# EAGLE schematic GND SATION PCB 1.01 (EAGLE 9.6.2)
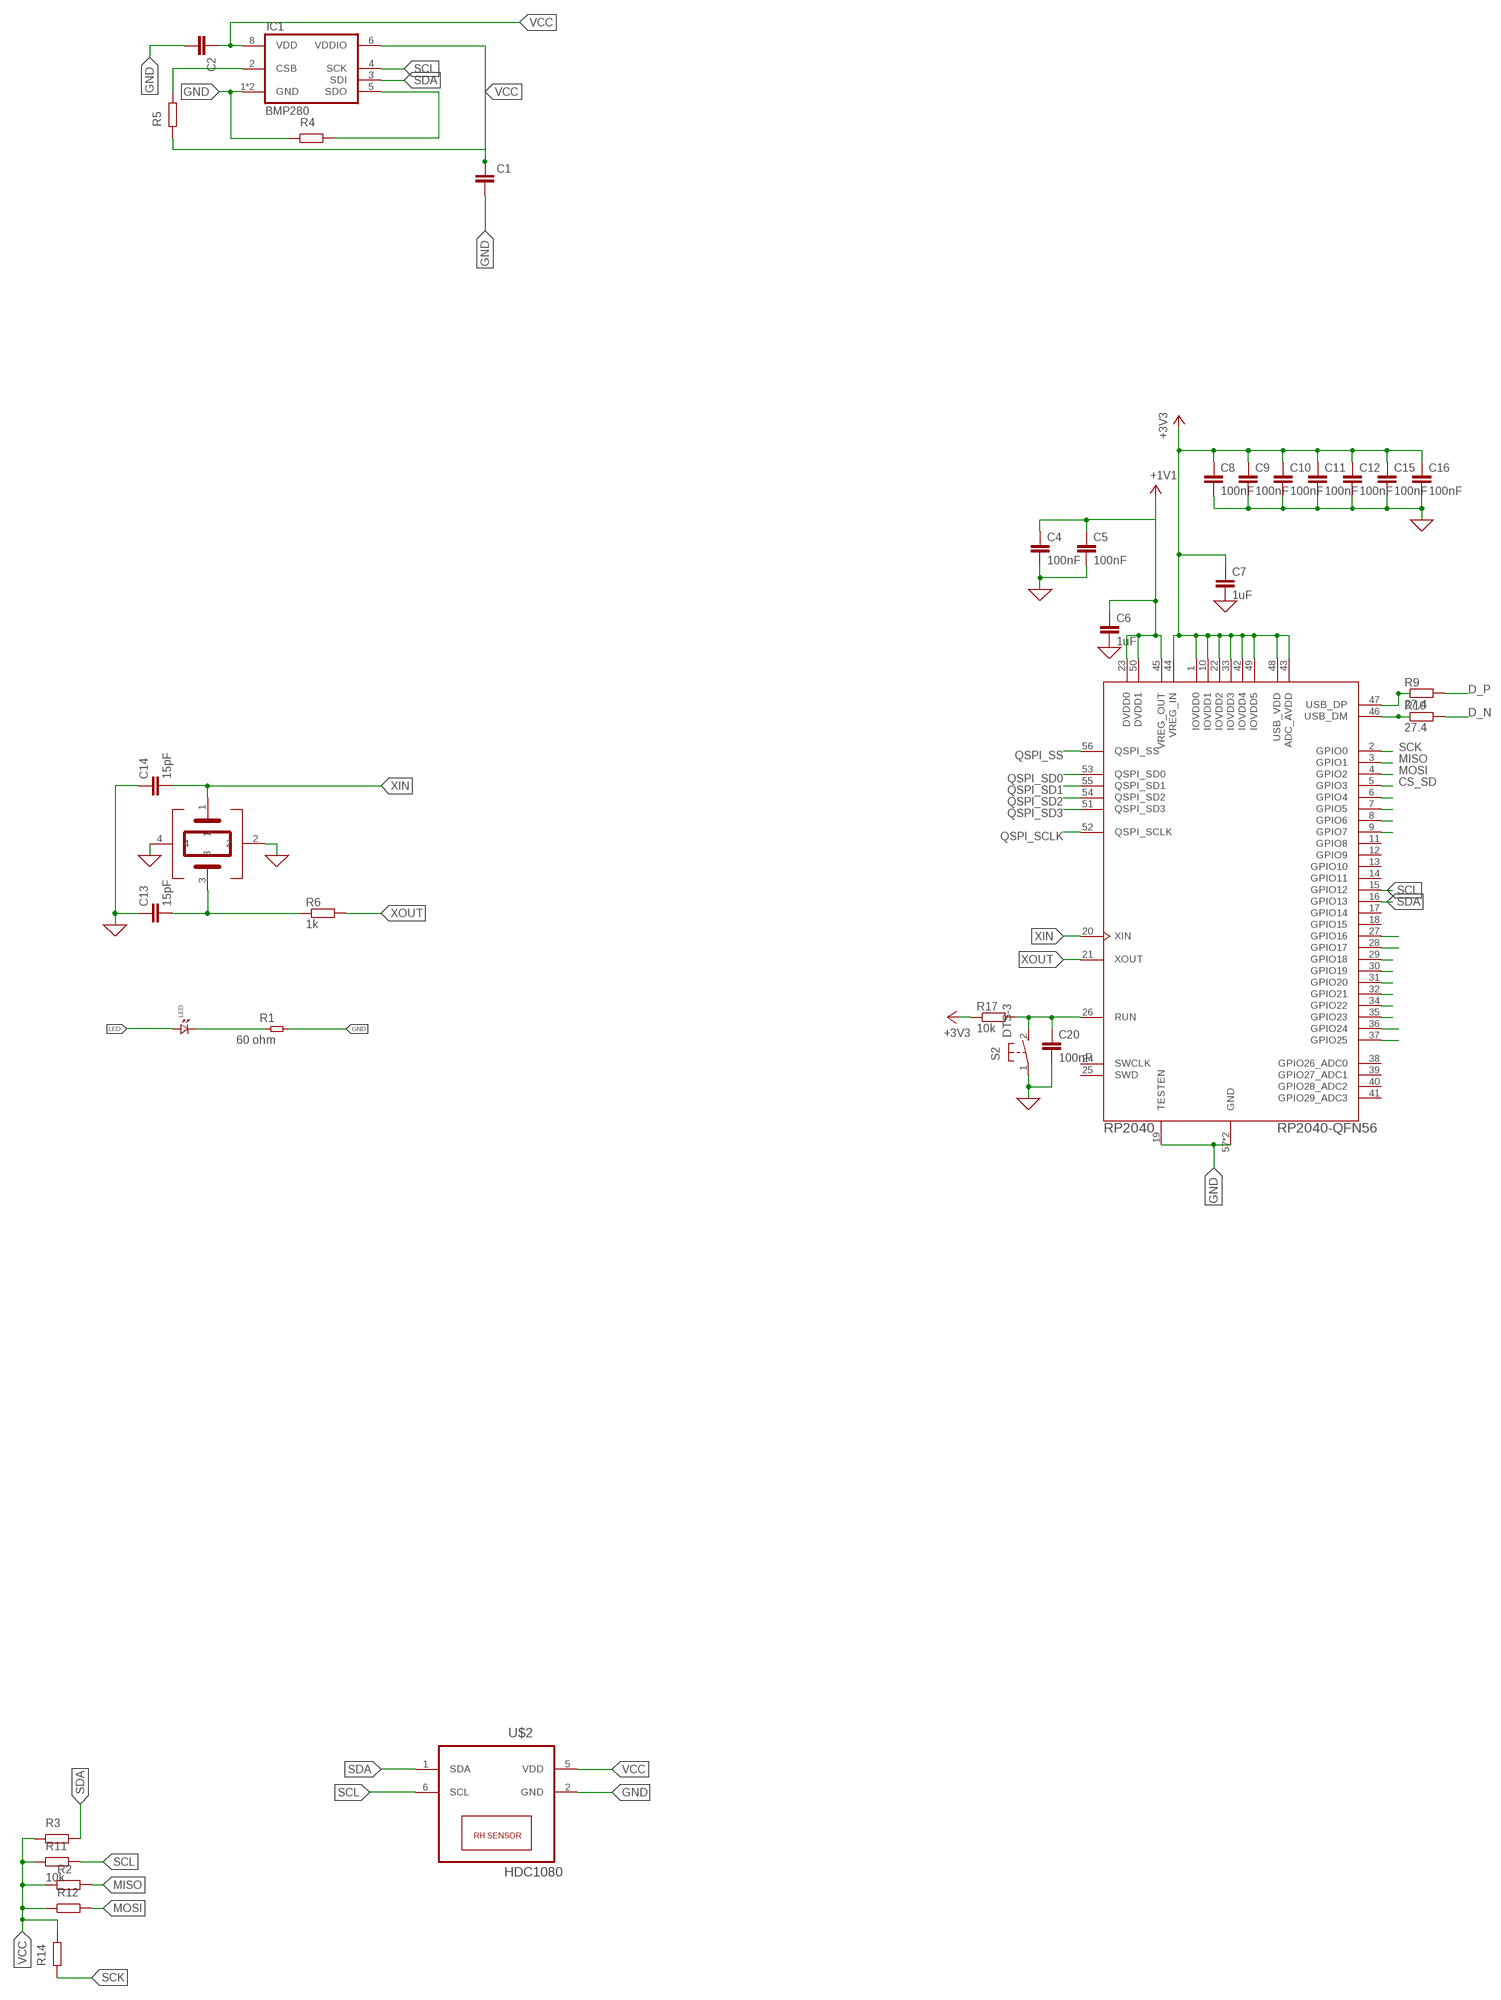
[diagram p0: schematic, sheet 1, part 1 of 2]
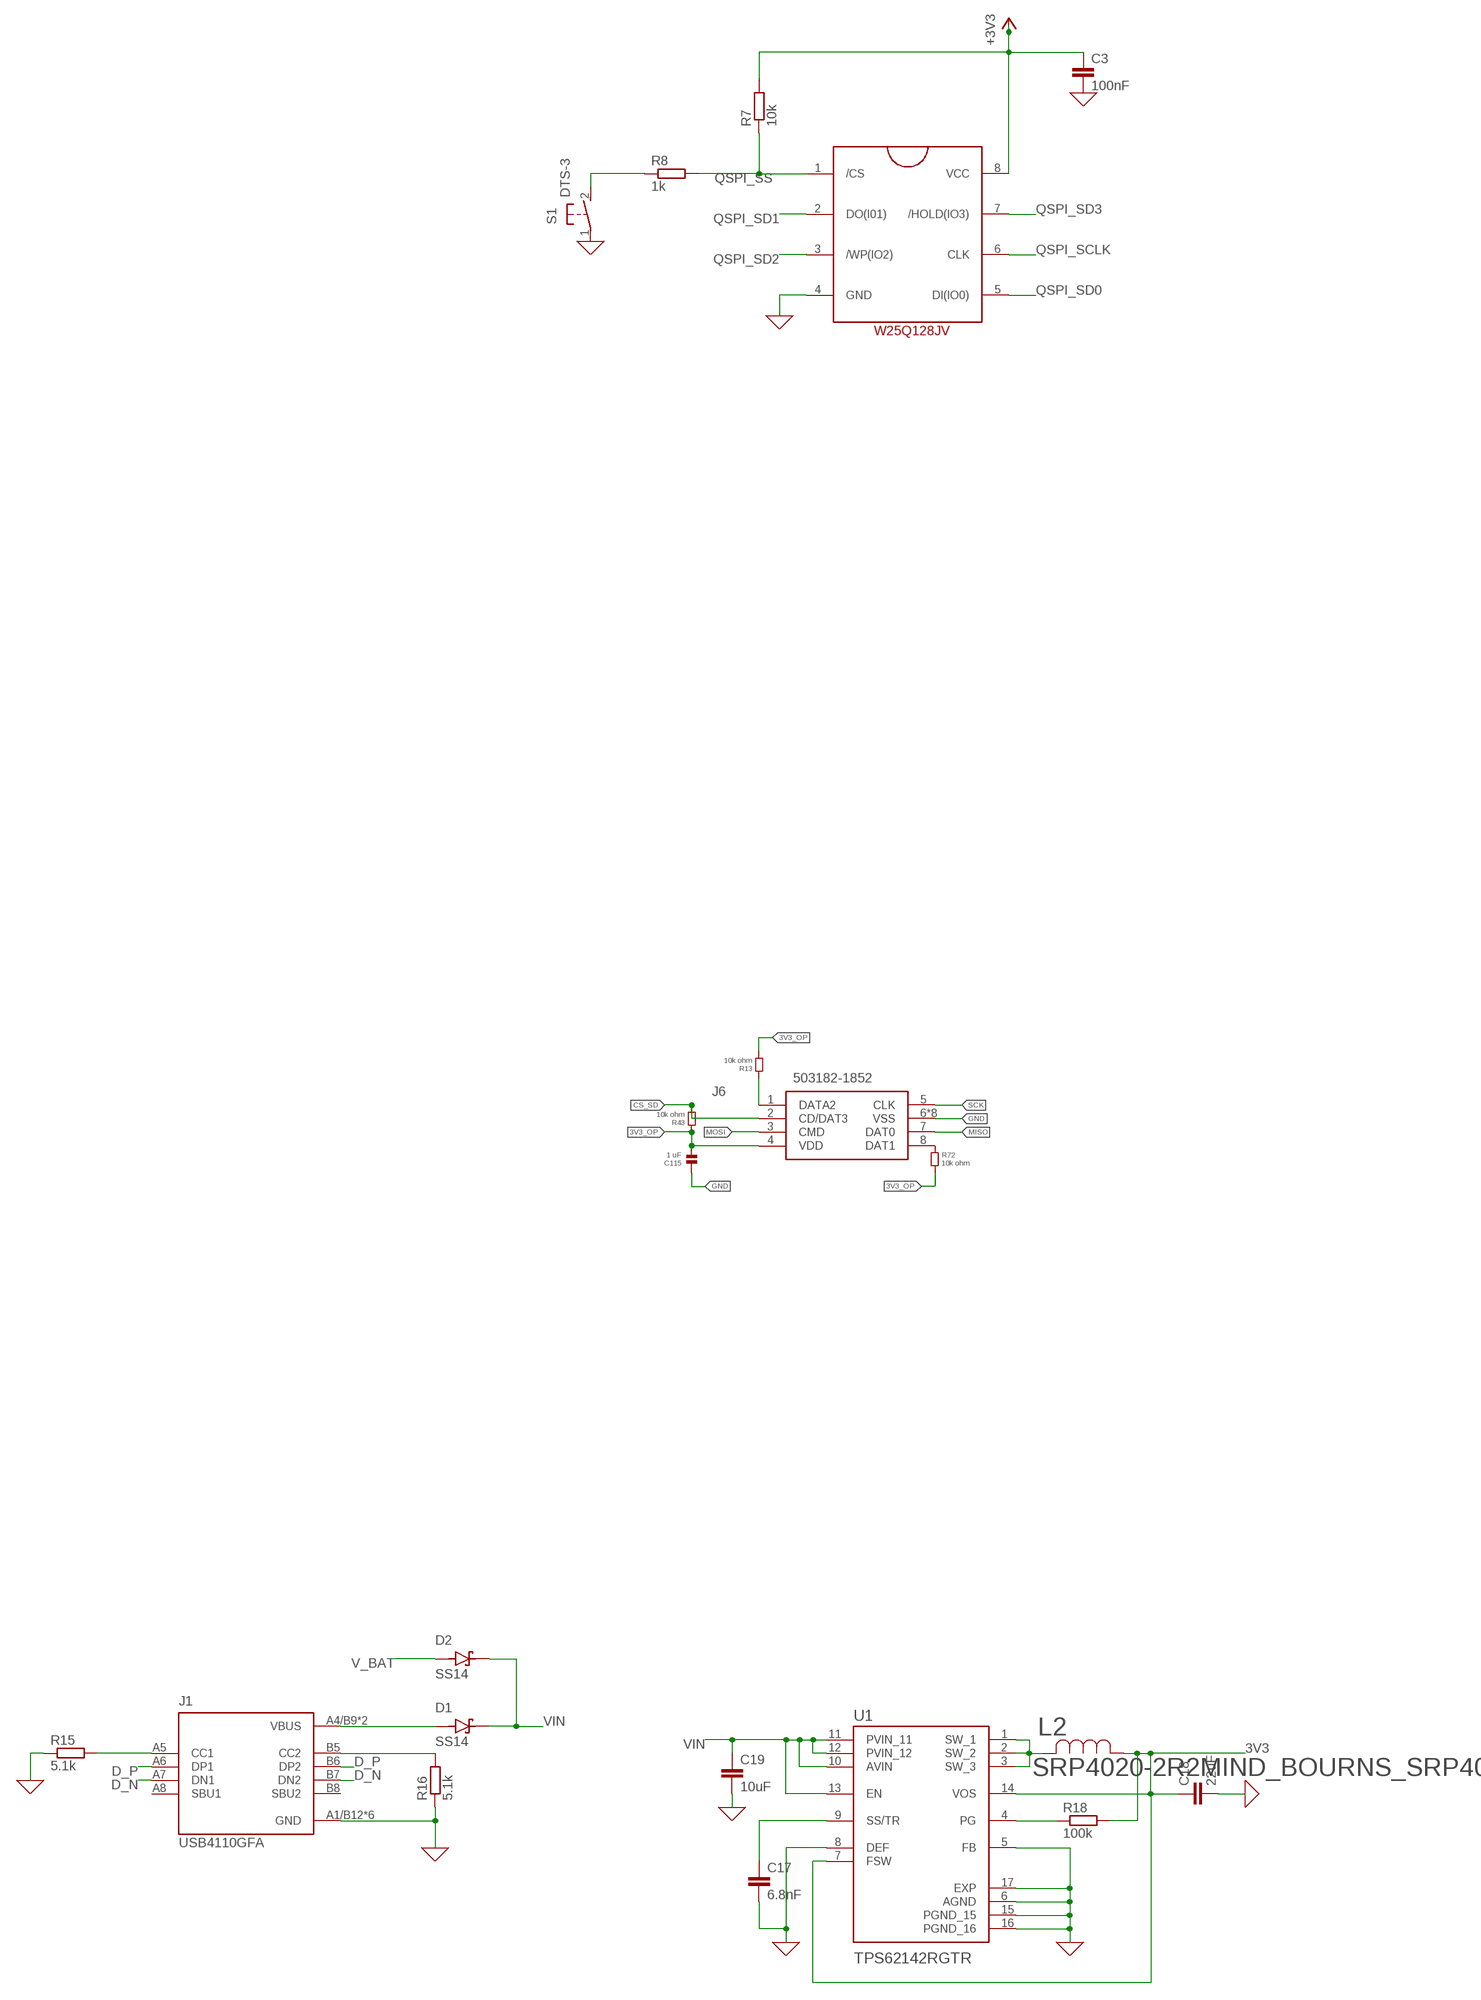
[diagram p1: schematic, sheet 1, part 2 of 2]

## Parts
C1  C  (no package)
C2  C  (no package)
C3  100nF  C-EUC0603  [C0603]
C4  100nF  C-EUC0603  [C0603]
C5  100nF  C-EUC0603  [C0603]
C6  1uF  C-EUC0603  [C0603]
C7  1uF  C-EUC0603  [C0603]
C8  100nF  C-EUC0603  [C0603]
C9  100nF  C-EUC0603  [C0603]
C10  100nF  C-EUC0603  [C0603]
C11  100nF  C-EUC0603  [C0603]
C12  100nF  C-EUC0603  [C0603]
C13  15pF  C-EUC0603  [C0603]
C14  15pF  C-EUC0603  [C0603]
C15  100nF  C-EUC0603  [C0603]
C16  100nF  C-EUC0603  [C0603]
C17  6.8nF  C-EUC0603  [C0603]
C18  22uF  C-EUC0603  [C0603]
C19  10uF  C-EUC0603  [C0603]
C20  100nF  C-EUC0603  [C0603]
C115  1 uF  CAPACITOR.0603  [0603]
D1  SS14  [DIOM4325X250N]
D2  SS14  [DIOM4325X250N]
IC1  BMP280  [BMP280]
J1  USB4110GFA  [GCT_USB4110GFA]
J6  503182-1852  [5031821852]
L2  SRP4020-2R2MIND_BOURNS_SRP4020  [IND_BOURNS_SRP4020]
LED  LED.0603  [0603.LED]
R1  60 ohm  RESISTOR.0603  [0603]
R2  R  (no package)
R3  R  (no package)
R4  R  (no package)
R5  R  (no package)
R6  1k  R-EU_R0603  [R0603]
R7  10k  R-EU_R0603  [R0603]
R8  1k  R-EU_R0603  [R0603]
R9  27.4  R-EU_R0603  [R0603]
R10  27.4  R-EU_R0603  [R0603]
R11  10k  R  (no package)
R12  R  (no package)
R13  10k ohm  RESISTOR.0603  [0603]
R14  R  (no package)
R15  5.1k  R-EU_R0603  [R0603]
R16  5.1k  R-EU_R0603  [R0603]
R17  10k  R-EU_R0603  [R0603]
R18  100k  R-EU_R0603  [R0603]
R43  10k ohm  RESISTOR.0603  [0603]
R72  10k ohm  RESISTOR.0603  [0603]
RP2040  RP2040-QFN56  [RP2040-QFN-56]
S1  DTS-3  [DTS-3]
S2  DTS-3  [DTS-3]
U1  TPS62142RGTR  [QFN50P300X300X100-17N]
U2  SOIC127P790X216-8NW25Q128JVJSQ  [SOIC127P790X216-8N]
U$1  ABM8-272-T3  [ABM8-272-T3]
U$2  HDC1080  [TI-S-PWSON-N6]

## Nets
0: C3.2 C4.2 C5.2 C6.2 C7.2 C8.2 C9.2 C10.2 C11.2 C12.2 C13.1 C14.1 C15.2 C16.2 C17.2 C18.2 C19.2 C20.2 J1.A1/B12(GND) J1.B1/A12(GND) J1.S1(GND) J1.S2(GND) J1.S3(GND) J1.S4(GND) R15.1 R16.1 S1.1 S2.1 U1.5(FB) U1.6(AGND) U1.8(DEF) U1.15(PGND_15) U1.16(PGND_16) U1.17(EXP) U2.4(GND) U$1.2 U$1.4 ; supply symbol labelled GND
1V1: C4.1 C5.1 C6.1 RP2040.23(DVDD0) RP2040.45(VREG_OUT) RP2040.50(DVDD1) ; supply symbol labelled +1V1
3V3: C18.1 L2.1 R18.2 U1.7(FSW) U1.14(VOS)
3V3_OP: C115.2 J6.4(VDD) R13.2 R43.1 R72.2
+3V3: C3.1 C7.1 C8.1 C9.1 C10.1 C11.1 C12.1 C15.1 C16.1 R7.2 R17.1 RP2040.1(IOVDD0) RP2040.10(IOVDD1) RP2040.22(IOVDD2) RP2040.33(IOVDD3) RP2040.42(IOVDD4) RP2040.43(ADC_AVDD) RP2040.44(VREG_IN) RP2040.48(USB_VDD) RP2040.49(IOVDD5) U2.8(VCC)
CS_SD: J6.2(CD/DAT3) R43.2 RP2040.5(GPIO3)
D_N: J1.A7(DN1) J1.B7(DN2) R10.2
D_P: J1.A6(DP1) J1.B6(DP2) R9.2
DROGUE: RP2040.29(GPIO18)
FIN_1: RP2040.9(GPIO7)
FIN_2: RP2040.8(GPIO6)
FIN_3: RP2040.7(GPIO5)
FIN_4: RP2040.6(GPIO4)
GND: C1.2 C2.2 C115.1 IC1.1(GND) IC1.7(GND) J6.6(VSS) J6.9(VSS) J6.10(VSS) J6.11(VSS) J6.12(VSS) J6.13(VSS) J6.14(VSS) J6.15(VSS) R1.2 R4.1 RP2040.19(TESTEN) RP2040.57(GND) RP2040.62(GND) U$2.2(GND)
GPS_RX: RP2040.27(GPIO16)
GPS_TX: RP2040.28(GPIO17)
IGN1: RP2040.31(GPIO20)
IGN2: RP2040.32(GPIO21)
LED: LED.P$1
MAIN: RP2040.30(GPIO19)
MISO: J6.7(DAT0) R2.2 RP2040.3(GPIO1)
MOSI: J6.3(CMD) R12.2 RP2040.4(GPIO2)
N$1: IC1.5(SDO) R4.2
N$2: LED.P$2 R1.1
N$3: IC1.2(CSB) R5.2
N$4: C13.2 R6.1 U$1.3
N$5: R8.1 S1.2
N$6: R9.1 RP2040.47(USB_DP)
N$7: R10.1 RP2040.46(USB_DM)
N$8: J6.1(DATA2) R13.1
N$9: D1.A J1.A4/B9(VBUS) J1.B4/A9(VBUS)
N$10: C17.1 U1.9(SS/TR)
N$11: J1.A5(CC1) R15.2
N$12: J6.8(DAT1) R72.1
N$14: C20.1 R17.2 RP2040.26(RUN) S2.2
N$15: J1.B5(CC2) R16.2
N$17: L2.2 U1.1(SW_1) U1.2(SW_2) U1.3(SW_3)
N$20: R18.1 U1.4(PG)
QSPI_SCLK: RP2040.52(QSPI_SCLK) U2.6(CLK)
QSPI_SD0: RP2040.53(QSPI_SD0) U2.5(DI(IO0))
QSPI_SD1: RP2040.55(QSPI_SD1) U2.2(DO(I01))
QSPI_SD2: RP2040.54(QSPI_SD2) U2.3(/WP(IO2))
QSPI_SD3: RP2040.51(QSPI_SD3) U2.7(/HOLD(IO3))
QSPI_SS: R7.1 R8.2 RP2040.56(QSPI_SS) U2.1(/CS)
RSSI: RP2040.35(GPIO23)
SCK: J6.5(CLK) R14.1 RP2040.2(GPIO0)
SCL: IC1.4(SCK) R11.2 RP2040.15(GPIO12) U$2.6(SCL)
SDA: IC1.3(SDI) R3.2 RP2040.16(GPIO13) U$2.1(SDA)
TEL_RST: RP2040.34(GPIO22)
TEL_RX: RP2040.36(GPIO24)
TEL_TX: RP2040.37(GPIO25)
V_BAT: D2.A
VCC: C1.1 C2.1 IC1.6(VDDIO) IC1.8(VDD) R2.1 R3.1 R5.1 R11.1 R12.1 R14.2 U$2.5(VDD)
VIN: C19.1 D1.C(K) D2.C(K) U1.10(AVIN) U1.11(PVIN_11) U1.12(PVIN_12) U1.13(EN)
XIN: C14.2 RP2040.20(XIN) U$1.1
XOUT: R6.2 RP2040.21(XOUT)
Unconnected: J1.A8(SBU1) J1.B8(SBU2) RP2040.11(GPIO8) RP2040.12(GPIO9) RP2040.13(GPIO10) RP2040.14(GPIO11) RP2040.17(GPIO14) RP2040.18(GPIO15) RP2040.24(SWCLK) RP2040.25(SWD) RP2040.38(GPIO26_ADC0) RP2040.39(GPIO27_ADC1) RP2040.40(GPIO28_ADC2) RP2040.41(GPIO29_ADC3)

## Library data of the parts
C1 C2 = ngspice-simulation:C: CAPACITOR
C3-C20 = rcl:C-EU: CAPACITOR, European symbol; SPICEPREFIX: C
C115 = standardparts:CAPACITOR
D1 D2 = SS14:SS14: Check availability <https://pricing.snapeda.com/parts/SS14/Taiwan%20Semiconductor/view-part?ref=eda>; AVAILABILITY: In Stock; CHECK_PRICES: https://www.snapeda.com/parts/SS14/taiwan/view-part/?ref=eda; DESCRIPTION: 1A, 40V, Schottky Rectifier; MF: Taiwan Semiconductor; MP: SS14; PACKAGE: SMA-2 Taiwan Semiconductor; PRICE: None; SNAPEDA_LINK: https://www.snapeda.com/parts/SS14/taiwan/view-part/?ref=snap
IC1 = BMP280-standalone:BMP280: The BMP280 is an absolute barometric pressure sensor especially designed for mobile applications. The sensor module is housed in an extremely compact 8-pin metal-lid LGA package with a footprint of only 2.0 × 2.5 mm2 and 0.95 mm package height. Its small dimensions and its low power consumption of 2.7 μA @1Hz allow the implementation in battery driven devices such as mobile phones, GPS modules or watches. The library has been designed by Richard Magdycz <https://www.facebook.com/groups/eaglecadsoftUK>
J1 = USB4110GFA:USB4110GFA: Check availability <https://pricing.snapeda.com/parts/USB4110GFA/GCT/view-part?ref=eda>; AVAILABILITY: In Stock; DESCRIPTION: USB-C (USB TYPE-C) USB 2.0 Receptacle Connector 24 (16+8 Dummy) Position Surface Mount, Right Angle; Through Hole; MF: GCT; MP: USB4110GFA; PACKAGE: None; PRICE: None
J6 = 503182-1852:503182-1852: Micro SD Normal UltraLowPro8CktEmbsTpPkg Source: Datasheet <https://www.molex.com/pdm_docs/sd/5031821852_sd.pdf>; DESCRIPTION: Micro SD Normal UltraLowPro8CktEmbsTpPkg; HEIGHT: mm; MANUFACTURER_NAME: Molex; MANUFACTURER_PART_NUMBER: 503182-1852
L2 = SRP4020-2R2M:SRP4020-2R2M; COPYRIGHT: Copyright (C) 2025 Ultra Librarian. All rights reserved.; MANUFACTURER_PART_NUMBER: SRP4020-2R2M; MFR_NAME: Bourns Electronics
LED = standardparts:LED
R1 R13 R43 R72 = standardparts:RESISTOR
R2-R5 R11 R12 R14 = ngspice-simulation:R: RESISTOR
R6-R10 R15-R18 = rcl:R-EU_: RESISTOR, European symbol; SPICEPREFIX: R
RP2040 = RpiPico:RP2040-QFN56
S1 S2 = DTS-3:DTS-3: Check availability <https://pricing.snapeda.com/parts/DTS-3/APEM%20Inc./view-part?ref=eda>; AVAILABILITY: Not in stock; CHECK_PRICES: https://www.snapeda.com/parts/DTS-3/APEM/view-part/?ref=eda; DESCRIPTION: Tactile Switch SPST-NO Top Actuated Through Hole; MF: APEM Inc.; MP: DTS-3; PACKAGE: DIP-10 APEM Inc.; PRICE: None; SNAPEDA_LINK: https://www.snapeda.com/parts/DTS-3/APEM/view-part/?ref=snap
U1 = TPS62142RGTR:TPS62142RGTR: Check availability <https://pricing.snapeda.com/parts/TPS62142RGTR/Texas%20Instruments/view-part?ref=eda>; AVAILABILITY: In Stock; CHECK_PRICES: https://www.snapeda.com/parts/TPS62142RGTR/Texas+Instruments/view-part/?ref=eda; DESCRIPTION: 3–17V 2A Step-Down Converter in 3x3 QFN package; MF: Texas Instruments; MP: TPS62142RGTR; PACKAGE: VQFN-16 Texas Instruments; PRICE: None; SNAPEDA_LINK: https://www.snapeda.com/parts/TPS62142RGTR/Texas+Instruments/view-part/?ref=snap
U2 = SOIC127P790X216-8N:SOIC127P790X216-8N
U$1 = ABM8-272-T3:ABM8-272-T3: Check availability <https://pricing.snapeda.com/parts/ABM8-272-T3/ABRACON/view-part?ref=eda>; AVAILABILITY: In Stock; CHECK_PRICES: https://www.snapeda.com/parts/ABM8-272-T3/Abracon/view-part/?ref=eda; DESCRIPTION: 12 MHz ±30ppm Crystal 10pF 50 Ohms 4-SMD, No Lead; MF: ABRACON; MP: ABM8-272-T3; PACKAGE: NON-STANDARD-4 Abracon; PRICE: None; SNAPEDA_LINK: https://www.snapeda.com/parts/ABM8-272-T3/Abracon/view-part/?ref=snap
U$2 = Texas-HDC1080:HDC1080